# EasyEDA Pro project ProDoc_OHPP-005B.epro, board OHPP-005B
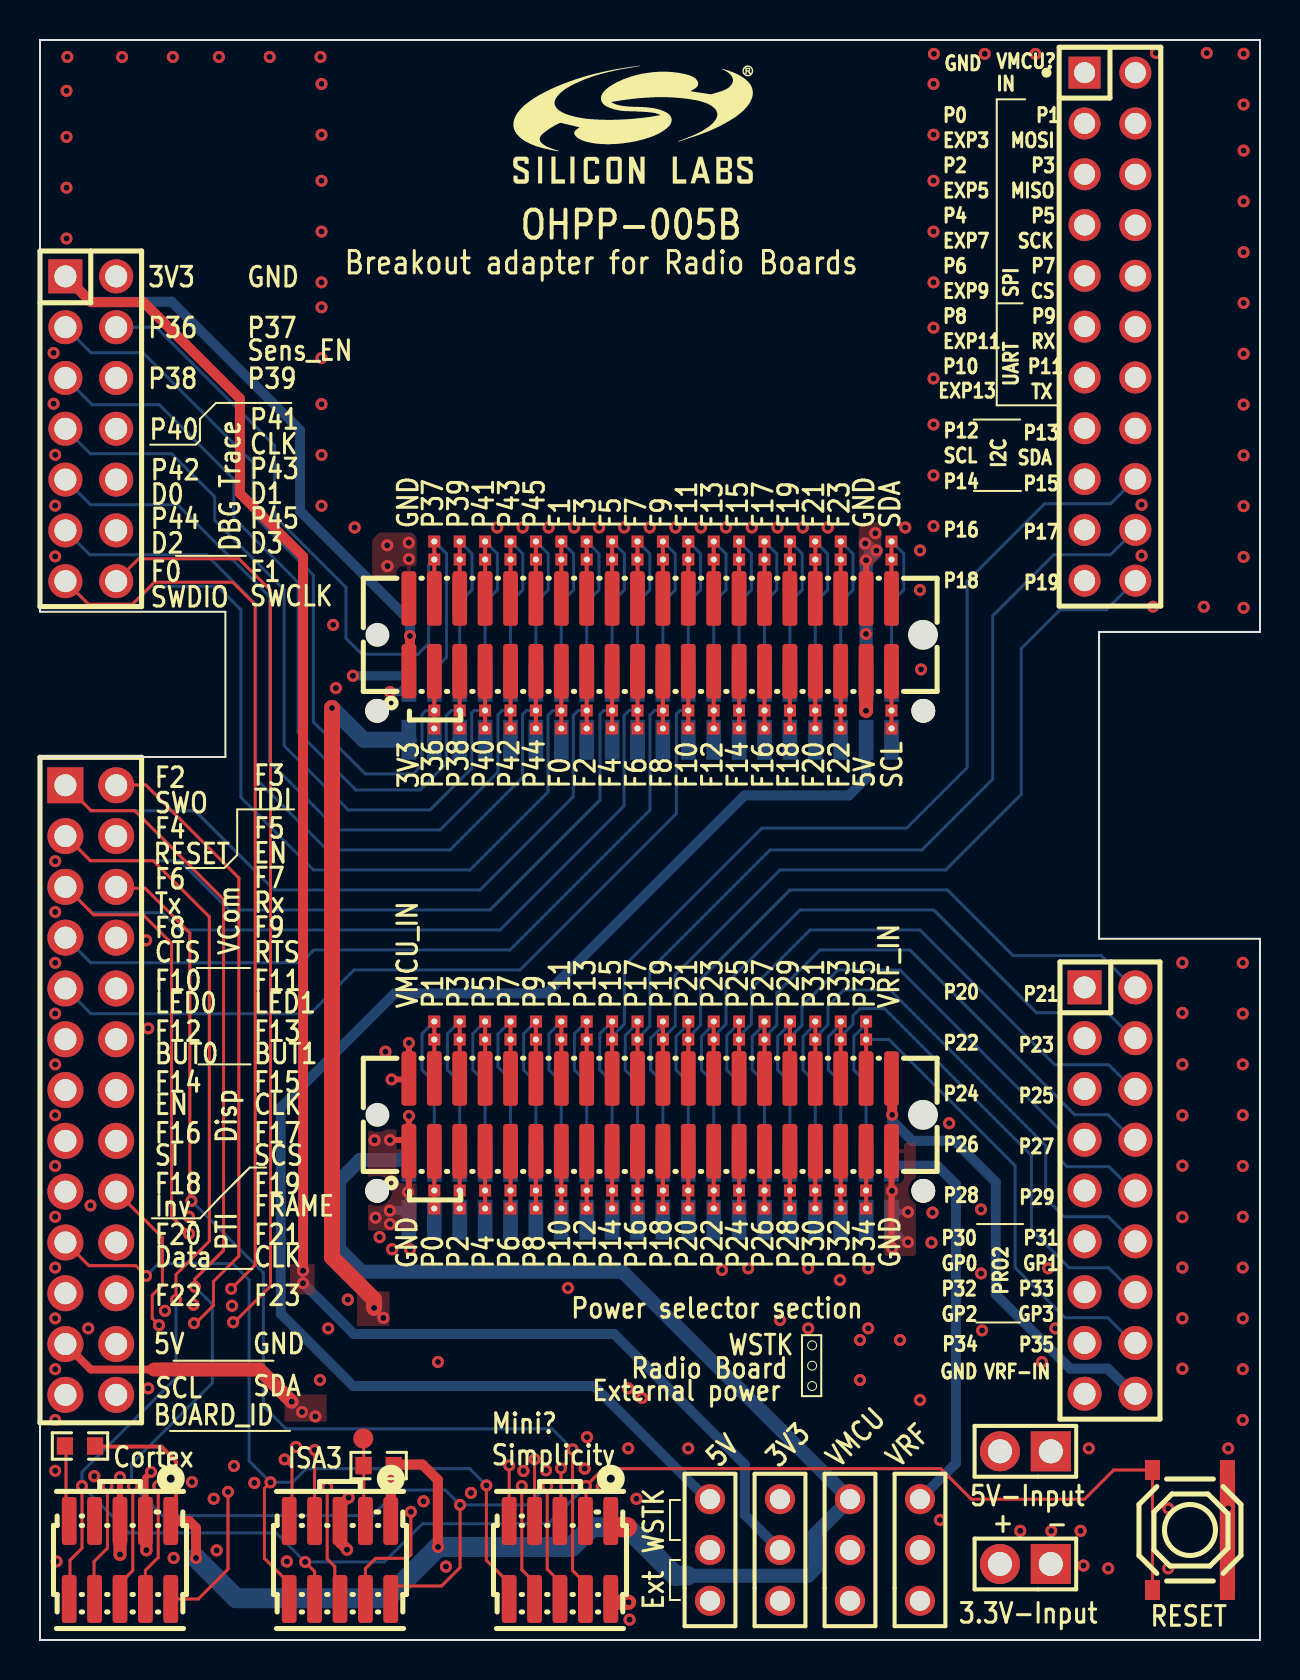
[diagram p3: board, top side]
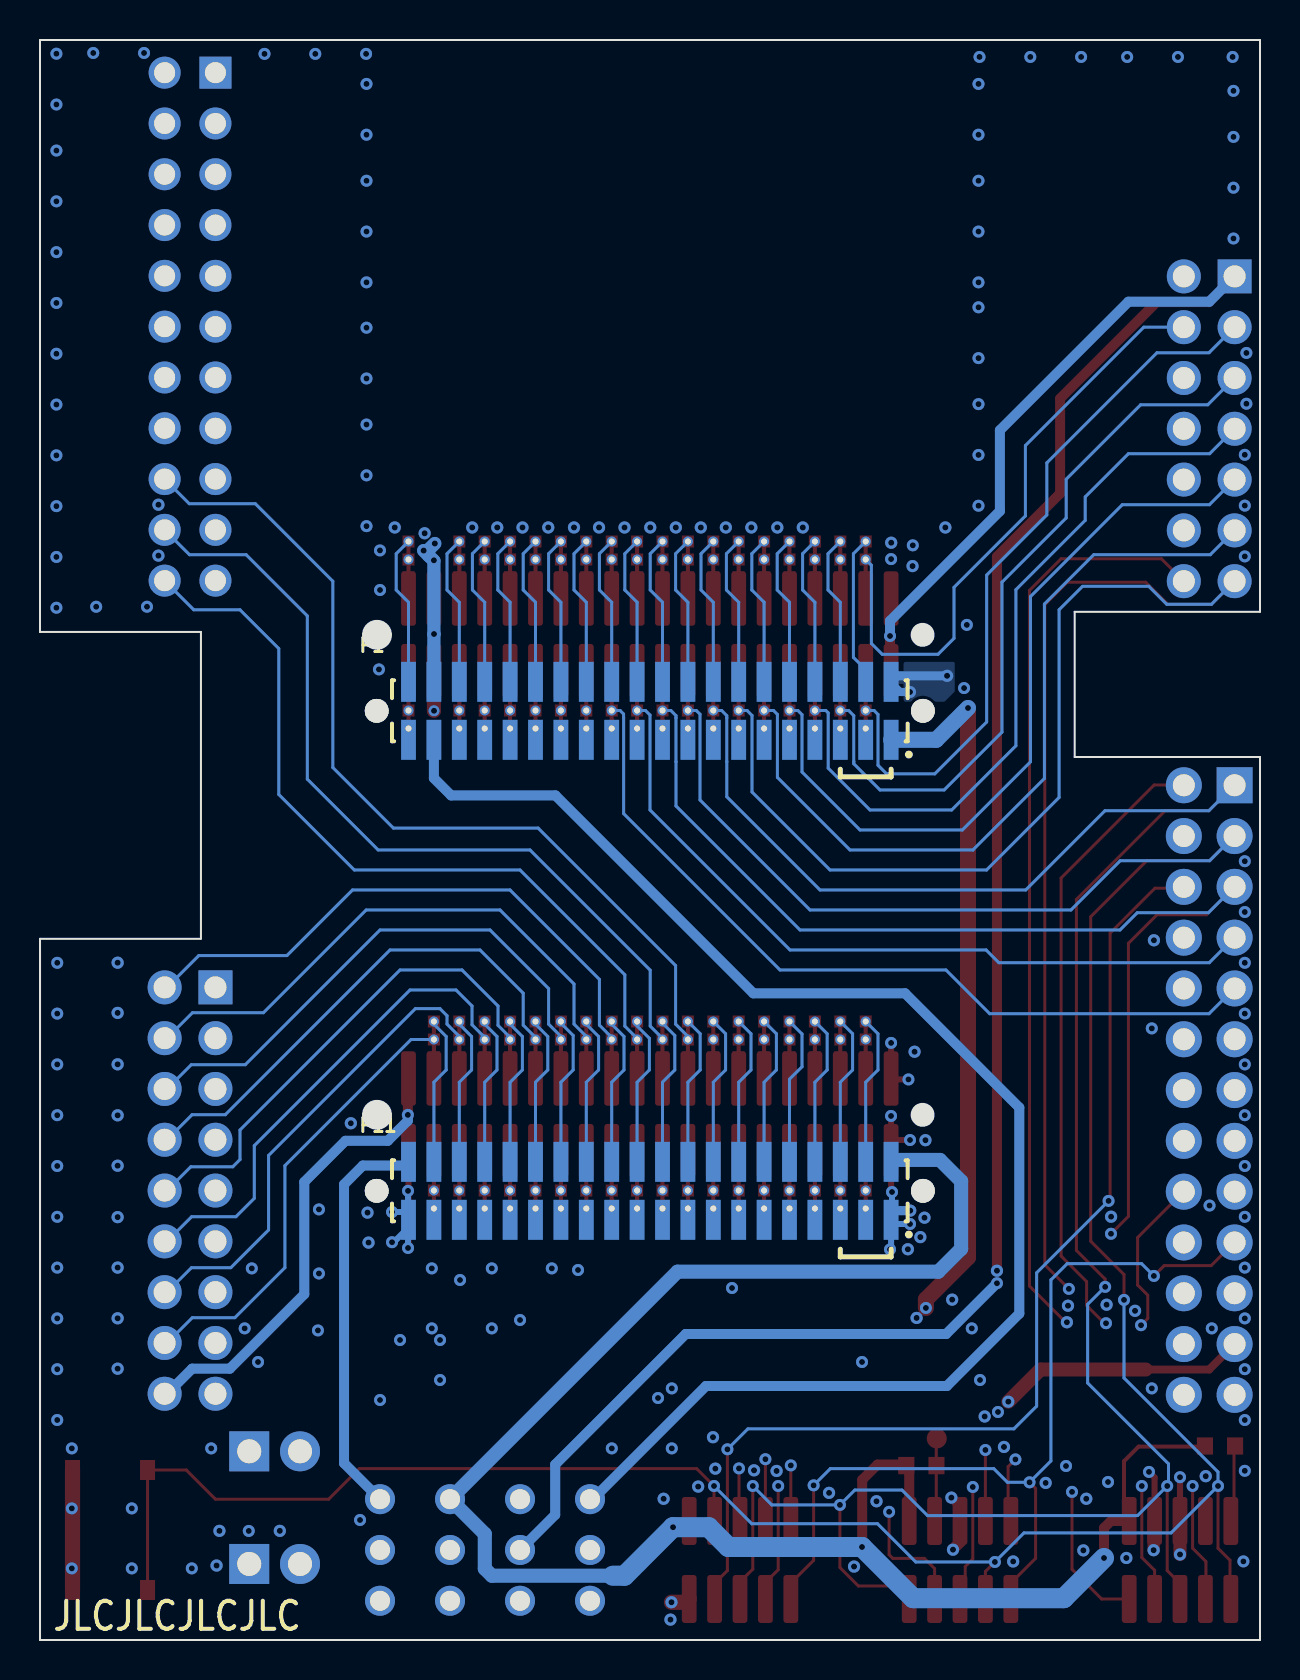
[diagram p4: board, bottom side, seen from below]

Outline 61 x 80 mm; copper layers: Top Layer, GND1, Inner1, Inner2, GND2, Bottom Layer. Coordinates in mm from the lower left corner of the outline.
Outline path: 61,8 61,35.06 52.96,35.06 52.96,50.4 61,50.4 61,80 0,80 0,51.41 9.27,51.41 9.27,44.15 0,44.15 0,0 61,0 61,34.5 ; 61,58.49 61,63
Stack: Top Layer 0.035mm Outer layer thickness 1oz / Dielectric1 0.0994mm 3313 RC57% 4.2mil / GND1 0.0152mm Inner layer thickness / Dielectric2 0.55mm 0.55mm H/H No copper / Inner1 0.0152mm Inner layer thickness / Dielectric3 0.1088mm 2116 RC54% 4.9mil / Inner2 0.0152mm Inner layer thickness / Dielectric4 0.55mm 0.55mm H/H No copper / GND2 0.0152mm Inner layer thickness / Dielectric5 0.0994mm 3313 RC57% 4.2mil / Bottom Layer 0.035mm Outer layer thickness 1oz

## Design rules (mm)
template: Custom Config
spacing copperThickness1oz (default): track to track 0.152, other pairs 0 to 0.3
spacing copperThickness2oz: track to track 0.203, other pairs 0.152 to 0.3
spacing copperThicknessInner0.5oz: track to track 0.089, other pairs 0.152 to 0.3
track width copperThickness1oz (default): min 0.15, default 0.15, max 2.54
track width copperThickness2oz: min 0.203, default 0.254, max 2.54
track width copperThickness0.5oz: min 0.089, default 0.254, max 2.54
differential pair differentialPair (default): width min 0.127, default 0.254, max 2.54; gap min 0.152, default 0.152
via viaSize (default): diameter min 0.3, default 0.61, max 10; hole min 0.2, default 0.305, max 6.3

## Placement (name value [footprint] x y rotation side)
H3  2.54-1*3  [HDR-TH_3P-P2.54-V-M-1]  40.5 4.5 90 top
H7  2.54-1*3  [HDR-TH_3P-P2.54-V-M-1]  44 4.5 90 top
H8  2.54-1*3  [HDR-TH_3P-P2.54-V-M-1]  37 4.5 90 top
H9  2.54-1*3  [HDR-TH_3P-P2.54-V-M-1]  33.5 4.5 90 top
H15  X6521WV-2x09H-C60D30  [HDR-TH_18P-P2.54-V-M-R2-C9-S2.54]  53.5 22.47 270 top
H16  X6521WV-2x11H-C60D30  [HDR-TH_22P-2.54-V-M-R2-C11-S2.54]  53.5 65.67 270 top
H17  X6521WV-2x13H-C60D30  [HDR-TH_26P-P2.54-V-M-R2-C13-S2.54]  2.54 27.5 270 top
H18  X6521WV-2x07H-C60D30  [HDR-TH_14P-P2.54-V-M-R2-C7-S2.54]  2.54 60.56 270 top
P1  *  [SAMTEC_SFC-120-T2-F-D-LC_1]  30.51 46.46 180 bottom
P3  3131-40MG0BK00T2  [CONN-SMD_40P-P1.27_WCON_3131-40MG0BK00T2_1]  30.51 50.26 180 top
P4  3131-40MG0BK00T2  [CONN-SMD_40P-P1.27_WCON_3131-40MG0BK00T2_1]  30.51 26.26 180 top
P5  -  [JUMPER_RECT_3PIN_NSNS]  19.72 22.47 90 top
P6  23bddce16d364f51bbc85156d37ba6bb  [IDC-SMD_3132-10MG0BK00R2_1]  26 4 180 top
P9  23bddce16d364f51bbc85156d37ba6bb  [IDC-SMD_3132-10MG0BK00R2_1]  4 4 180 top
P10  23bddce16d364f51bbc85156d37ba6bb  [IDC-SMD_3132-10MG0BK00R2_1]  15 4 180 top
P11  *  [SAMTEC_SFC-120-T2-F-D-LC_1]  30.51 22.46 180 bottom
P13  -  [JUMPER_RECT_3PIN_NSNS]  19.72 30.02 270 top
P14  -  [JUMPER_RECT_3PIN_NSNS]  20.99 22.47 90 top
P15  -  [JUMPER_RECT_3PIN_NSNS]  20.99 30.02 270 top
P16  -  [JUMPER_RECT_3PIN_NSNS]  22.26 22.47 90 top
P17  -  [JUMPER_RECT_3PIN_NSNS]  22.26 30.02 270 top
P18  -  [JUMPER_RECT_3PIN_NSNS]  23.53 22.47 90 top
P19  -  [JUMPER_RECT_3PIN_NSNS]  23.53 30.02 270 top
P20  -  [JUMPER_RECT_3PIN_NSNS]  24.8 22.47 90 top
P21  -  [JUMPER_RECT_3PIN_NSNS]  24.8 30.02 270 top
P22  -  [JUMPER_RECT_3PIN_NSNS]  26.07 22.47 90 top
P23  -  [JUMPER_RECT_3PIN_NSNS]  26.07 30.02 270 top
P24  -  [JUMPER_RECT_3PIN_NSNS]  27.34 22.47 90 top
P25  -  [JUMPER_RECT_3PIN_NSNS]  27.34 30.02 270 top
P26  -  [JUMPER_RECT_3PIN_NSNS]  28.61 22.47 90 top
P27  -  [JUMPER_RECT_3PIN_NSNS]  28.61 30.02 270 top
P28  -  [JUMPER_RECT_3PIN_NSNS]  29.88 22.47 90 top
P29  -  [JUMPER_RECT_3PIN_NSNS]  29.88 30.02 270 top
P30  -  [JUMPER_RECT_3PIN_NSNS]  31.15 22.47 90 top
P31  -  [JUMPER_RECT_3PIN_NSNS]  31.15 30.02 270 top
P32  -  [JUMPER_RECT_3PIN_NSNS]  32.42 22.47 90 top
P33  -  [JUMPER_RECT_3PIN_NSNS]  32.42 30.02 270 top
P34  -  [JUMPER_RECT_3PIN_NSNS]  33.69 22.47 90 top
P35  -  [JUMPER_RECT_3PIN_NSNS]  33.69 30.02 270 top
P36  -  [JUMPER_RECT_3PIN_NSNS]  34.96 22.47 90 top
P37  -  [JUMPER_RECT_3PIN_NSNS]  34.96 30.02 270 top
P38  -  [JUMPER_RECT_3PIN_NSNS]  36.23 22.47 90 top
P39  -  [JUMPER_RECT_3PIN_NSNS]  36.23 30.02 270 top
P40  -  [JUMPER_RECT_3PIN_NSNS]  37.5 22.47 90 top
P41  -  [JUMPER_RECT_3PIN_NSNS]  37.5 30.02 270 top
P42  -  [JUMPER_RECT_3PIN_NSNS]  38.77 22.47 90 top
P43  -  [JUMPER_RECT_3PIN_NSNS]  38.77 30.02 270 top
P44  -  [JUMPER_RECT_3PIN_NSNS]  40.04 22.47 90 top
P45  -  [JUMPER_RECT_3PIN_NSNS]  40.04 30.02 270 top
P46  -  [JUMPER_RECT_3PIN_NSNS]  41.31 22.47 90 top
P47  -  [JUMPER_RECT_3PIN_NSNS]  41.31 30.02 270 top
P48  -  [JUMPER_RECT_3PIN_NSNS]  19.72 46.47 90 top
P49  -  [JUMPER_RECT_3PIN_NSNS]  19.72 54.02 270 top
P50  -  [JUMPER_RECT_3PIN_NSNS]  20.99 46.47 90 top
P51  -  [JUMPER_RECT_3PIN_NSNS]  20.99 54.02 270 top
P52  -  [JUMPER_RECT_3PIN_NSNS]  22.26 46.47 90 top
P53  -  [JUMPER_RECT_3PIN_NSNS]  22.26 54.02 270 top
P54  -  [JUMPER_RECT_3PIN_NSNS]  23.53 46.47 90 top
P55  -  [JUMPER_RECT_3PIN_NSNS]  23.53 54.02 270 top
P56  -  [JUMPER_RECT_3PIN_NSNS]  24.8 46.47 90 top
P57  -  [JUMPER_RECT_3PIN_NSNS]  24.8 54.02 270 top
P58  -  [JUMPER_RECT_3PIN_NSNS]  26.07 46.47 90 top
P59  -  [JUMPER_RECT_3PIN_NSNS]  26.07 54.02 270 top
P60  -  [JUMPER_RECT_3PIN_NSNS]  27.34 46.47 90 top
P61  -  [JUMPER_RECT_3PIN_NSNS]  27.34 54.02 270 top
P62  -  [JUMPER_RECT_3PIN_NSNS]  28.61 46.47 90 top
P63  -  [JUMPER_RECT_3PIN_NSNS]  29.88 54.02 270 top
P64  -  [JUMPER_RECT_3PIN_NSNS]  28.61 54.02 270 top
P65  -  [JUMPER_RECT_3PIN_NSNS]  29.88 46.47 90 top
P66  -  [JUMPER_RECT_3PIN_NSNS]  31.15 46.47 90 top
P67  -  [JUMPER_RECT_3PIN_NSNS]  31.15 54.02 270 top
P68  -  [JUMPER_RECT_3PIN_NSNS]  32.42 46.47 90 top
P69  -  [JUMPER_RECT_3PIN_NSNS]  32.42 54.02 270 top
P70  -  [JUMPER_RECT_3PIN_NSNS]  33.69 46.47 90 top
P71  -  [JUMPER_RECT_3PIN_NSNS]  33.69 54.02 270 top
P72  -  [JUMPER_RECT_3PIN_NSNS]  34.96 46.47 90 top
P73  -  [JUMPER_RECT_3PIN_NSNS]  34.96 54.02 270 top
P74  -  [JUMPER_RECT_3PIN_NSNS]  36.23 46.47 90 top
P75  -  [JUMPER_RECT_3PIN_NSNS]  36.23 54.02 270 top
P76  -  [JUMPER_RECT_3PIN_NSNS]  37.5 46.47 90 top
P77  -  [JUMPER_RECT_3PIN_NSNS]  37.5 54.02 270 top
P78  -  [JUMPER_RECT_3PIN_NSNS]  38.77 46.47 90 top
P79  -  [JUMPER_RECT_3PIN_NSNS]  38.77 54.02 270 top
P80  -  [JUMPER_RECT_3PIN_NSNS]  40.04 46.47 90 top
P81  -  [JUMPER_RECT_3PIN_NSNS]  40.04 54.02 270 top
P82  -  [JUMPER_RECT_3PIN_NSNS]  42.58 54.02 270 top
P83  -  [JUMPER_RECT_3PIN_NSNS]  42.58 46.47 90 top
R1  100kΩ  [R0603]  2 9.7 0 top
R2  100kΩ  [R0603]  16.93 8.72 0 top
SW2  TS-1187A-B-A-B  [SW-SMD_4P-L5.1-W5.1-P3.70-LS6.5-TL_H1.5]  57.5 5.5 90 top
TP1  -  [Test-Point-0.5mm]  16.16 10.08 0 top
U1  2.54-1*2  [HDR-TH_2P-P2.54-V-M]  49.27 3.8 180 top
U3  2.54-1*2  [HDR-TH_2P-P2.54-V-M]  49.27 9.43 180 top

## Footprints (pads in the part's own frame, mm; a bottom-side part is the same pattern mirrored in y, then rotated)
CONN-SMD_40P-P1.27_WCON_3131-40MG0BK00T2_1
  rrect 0.74x2.72 smd: 1(12.065,1.815) 2(12.065,-1.815) 3(10.795,1.815) 4(10.795,-1.815) 5(9.525,1.815) 6(9.525,-1.815) 7(8.255,1.815) 8(8.255,-1.815) 9(6.985,1.815) 10(6.985,-1.815) 11(5.715,1.815) 12(5.715,-1.815) 13(4.445,1.815) 14(4.445,-1.815) 15(3.175,1.815) 16(3.175,-1.815) 17(1.905,1.815) 18(1.905,-1.815) 19(0.635,1.815) 20(0.635,-1.815) 21(-0.635,1.815) 22(-0.635,-1.815) 23(-1.905,1.815) 24(-1.905,-1.815) 25(-3.175,1.815) 26(-3.175,-1.815) 27(-4.445,1.815) 28(-4.445,-1.815) 29(-5.715,1.815) 30(-5.715,-1.815) 31(-6.985,1.815) 32(-6.985,-1.815) 33(-8.255,1.815) 34(-8.255,-1.815) 35(-9.525,1.815) 36(-9.525,-1.815) 37(-10.795,1.815) 38(-10.795,-1.815) 39(-12.065,1.815) 40(-12.065,-1.815)
HDR-TH_2P-P2.54-V-M
  rect 2x2 hole 1.2: 1(-1.27,0)
  round 2 hole 1.2: 2(1.27,0)
HDR-TH_3P-P2.54-V-M-1
  round 1.5 hole 1: 1(-2.54,0) 2(0,0) 3(2.54,0)
HDR-TH_14P-P2.54-V-M-R2-C7-S2.54
  rect 1.7x1.7 hole 1.1: 1(-7.62,-1.27)
  round 1.7 hole 1.1: 2(-7.62,1.27) 3(-5.08,-1.27) 4(-5.08,1.27) 5(-2.54,-1.27) 6(-2.54,1.27) 7(0,-1.27) 8(0,1.27) 9(2.54,-1.27) 10(2.54,1.27) 11(5.08,-1.27) 12(5.08,1.27) 13(7.62,-1.27) 14(7.62,1.27)
HDR-TH_18P-P2.54-V-M-R2-C9-S2.54
  rect 1.7x1.7 hole 1.1: 1(-10.16,-1.27)
  round 1.7 hole 1.1: 2(-10.16,1.27) 3(-7.62,-1.27) 4(-7.62,1.27) 5(-5.08,-1.27) 6(-5.08,1.27) 7(-2.54,-1.27) 8(-2.54,1.27) 9(0,-1.27) 10(0,1.27) 11(2.54,-1.27) 12(2.54,1.27) 13(5.08,-1.27) 14(5.08,1.27) 15(7.62,-1.27) 16(7.62,1.27) 17(10.16,-1.27) 18(10.16,1.27)
HDR-TH_22P-2.54-V-M-R2-C11-S2.54
  rect 1.6x1.6 hole 1.05: 1(-12.7,-1.27)
  round 1.6 hole 1.05: 2(-12.7,1.27) 3(-10.16,-1.27) 4(-10.16,1.27) 5(-7.62,-1.27) 6(-7.62,1.27) 7(-5.08,-1.27) 8(-5.08,1.27) 9(-2.54,-1.27) 10(-2.54,1.27) 11(0,-1.27) 12(0,1.27) 13(2.54,-1.27) 14(2.54,1.27) 15(5.08,-1.27) 16(5.08,1.27) 17(7.62,-1.27) 18(7.62,1.27) 19(10.16,-1.27) 20(10.16,1.27) 21(12.7,-1.27) 22(12.7,1.27)
HDR-TH_26P-P2.54-V-M-R2-C13-S2.54
  rect 1.8x1.8 hole 1.1: 1(-15.24,-1.27)
  round 1.8 hole 1.1: 2(-15.24,1.27) 3(-12.7,-1.27) 4(-12.7,1.27) 5(-10.16,-1.27) 6(-10.16,1.27) 7(-7.62,-1.27) 8(-7.62,1.27) 9(-5.08,-1.27) 10(-5.08,1.27) 11(-2.54,-1.27) 12(-2.54,1.27) 13(0,-1.27) 14(0,1.27) 15(2.54,-1.27) 16(2.54,1.27) 17(5.08,-1.27) 18(5.08,1.27) 19(7.62,-1.27) 20(7.62,1.27) 21(10.16,-1.27) 22(10.16,1.27) 23(12.7,-1.27) 24(12.7,1.27) 25(15.24,-1.27) 26(15.24,1.27)
IDC-SMD_3132-10MG0BK00R2_1
  rrect 0.74x2.4 smd: 1(-2.54,-1.95) 2(-2.54,1.95) 3(-1.27,-1.95) 4(-1.27,1.95) 5(0,-1.95) 6(0,1.95) 7(1.27,-1.95) 8(1.27,1.95) 9(2.54,-1.95) 10(2.54,1.95)
JUMPER_RECT_3PIN_NSNS
  round 0.5 hole 0.3: 1(-0.9,0) 2(0,0)
  rect 0.6x0.6 smd: 1(-0.9,0) 2(0,0) 3(0.9,0)
R0603
  rect 0.806x0.864 smd: 1(-0.753,0) 2(0.753,0)
SAMTEC_SFC-120-T2-F-D-LC_1
  round 1.19 hole 1.19: (-13.655,0) (13.655,0)
  rect 0.74x2 smd: 01(12.065,-1.45) 02(12.065,1.45) 03(10.795,-1.45) 04(10.795,1.45) 05(9.525,-1.45) 06(9.525,1.45) 07(8.255,-1.45) 08(8.255,1.45) 09(6.985,-1.45) 10(6.985,1.45) 11(5.715,-1.45) 12(5.715,1.45) 13(4.445,-1.45) 14(4.445,1.45) 15(3.175,-1.45) 16(3.175,1.45) 17(1.905,-1.45) 18(1.905,1.45) 19(0.635,-1.45) 20(0.635,1.45) 21(-0.635,-1.45) 22(-0.635,1.45) 23(-1.905,-1.45) 24(-1.905,1.45) 25(-3.175,-1.45) 26(-3.175,1.45) 27(-4.445,-1.45) 28(-4.445,1.45) 29(-5.715,-1.45) 30(-5.715,1.45) 31(-6.985,-1.45) 32(-6.985,1.45) 33(-8.255,-1.45) 34(-8.255,1.45) 35(-9.525,-1.45) 36(-9.525,1.45) 37(-10.795,-1.45) 38(-10.795,1.45) 39(-12.065,-1.45) 40(-12.065,1.45)
SW-SMD_4P-L5.1-W5.1-P3.70-LS6.5-TL_H1.5
  rect 1x0.75 smd: 1(-3,1.875) 2(3,1.875) 3(-3,-1.875) 4(3,-1.875)
Test-Point-0.5mm
  round 1 smd: 1(0,0)

## Nets
As in the schematic.

Pads without a net: P9 7

## Via types
v1: diameter 0.61, hole 0.305, Top Layer to Bottom Layer, 70 vias
v2: diameter 0.6, hole 0.3, Top Layer to Bottom Layer, 179 vias
v3: diameter 0.61, hole 0.3, Top Layer to Bottom Layer, 8 vias
v4: diameter 0.55, hole 0.3, Top Layer to Bottom Layer, 1 via

## Routing (per net, layer and track width the routed paths; a pad name or vN(x,y) marks a point on that pad's centre or on a via; arc(x,y) is an arc through that point)
3V3: length 62.5
  Top Layer w0.8: 14.6,46.6 14.6,19.13 16.71,17.03 v2(16.71,16.6)
  GND1 w0.658: v1(17.17,16.1) 17.17,16.14 v2(16.71,16.6)
  Inner1 w0.8: v2(16.71,16.6) 31.24,16.6 35.24,12.6 35.24,8.8 37,7.04
  Bottom Layer w0.8: 18.45,45.01 16.19,45.01 14.6,46.6
  vias: v2(14.6,46.6)
5V: length 73.4
  Bottom Layer w0.5: 33.33,7.07 27.7,12.7 15.66,12.7 12.04,16.32 12.04,26.62 17.75,32.33 25.33,32.33 35.23,42.23 40.44,42.23 41.31,43.09 41.31,45.01
GND: length 50.8
  Top Layer w0.15: P6.2 28.54,2.74
  Top Layer w0.3: 18.45,51.77 P3.2 ; v2(18.45,26.2) 18.45,26.2 18.45,25.06 18.39,25 v2(17.5,25) ; P4.39 42.58,19.63 v2(42.6,19.6) ; P4.1 18.45,22.45 18.4,22.4 ; P3.38 v2(41.31,53.99)
  Top Layer w0.305: v2(5.55,8.4) 5.27,8.12 P9.3 ; P9.5 v2(4,8.14)
  Top Layer w0.455: 15.45,7.14 15,6.69 P10.5
  Top Layer w0.556: 15.35,4.54 15,4.89 P10.5
  Top Layer w0.607: P9.3 5.32,5.9 v1(5.32,4.49)
  Top Layer w0.658: v1(4,4.28) P9.5
  Top Layer w0.759: SW2.4 SW2.3 ; v1(29.43,1.89) 28.7,1.89 P6.2
  Bottom Layer w0.3: v2(43.4,19.89) 43.31,19.89 42.7,20.5 ; 17.5,20.8 18.24,20.8 P11.01 18.45,19.58 v2(18.5,19.53) ; 18.4,21.47 18.4,22.4 ; v2(42.6,19.6) 42.6,22.5 ; 42.7,21.4 43.4,21.4
  Bottom Layer w0.404: P1.02 18.45,47.84 18,47.4 v2(17.5,47.4)
  Bottom Layer w0.455: P1.02 18.15,48.21 v1(15.65,48.21) ; v1(17.49,21.47) 18.4,21.47 18.4,21.05 P11.01
  Bottom Layer w0.658: 41.31,50.29 41.31,53.96 41.57,54.22 ; 41.31,50.29 P1.38 ; 41.31,50.29 v2(41.3,50.3) ; 41.57,54.22 v1(41.82,54.47) ; 41.57,54.22 41.57,54.51 v1(41.26,54.83)
  vias: v1(2.71,8.19) v1(6.25,16.46) v1(6.68,4.1) v1(7.67,16.76) v1(8.69,7.06) v1(8.83,4.48) v1(9.6,16.71) v1(12.8,9.65) v1(15.39,17.02) v1(15.43,7.12) v1(15.35,4.52) v1(15.73,55.63) v1(16.73,24.99) v1(16.78,21.12) v1(16.98,20.15) v1(17.27,29.41) v1(17.37,53.7) v1(17.61,19.54) v1(18.44,54.86) v1(19.18,6.94) v1(20.3,3.67) v1(22.86,55.63) v1(24.13,55.63) v1(24.17,8.45) v1(25.3,8.48) v1(25.43,55.63) v1(26.71,55.63) v1(27.35,10.14) v1(27.96,55.63) v1(28.09,7.67) v1(29.21,55.63) v1(29.48,1.02) v1(29.82,7.06) v1(30.49,55.63) v1(31.77,55.63) v1(33.05,55.63) v1(34.3,55.63) v1(35.59,55.63) v1(36.88,55.63) v1(38.14,55.63) v1(39.39,55.63) v1(41.77,55.34) v1(43.26,55.63) v1(44.63,21.37) v1(44.57,19.87) v1(49.01,5.46) v1(52.03,5.46) v1(52.17,3.72) v1(55.08,56.76) v1(55.08,54.22) v1(57.12,33.86) v1(57.12,31.35) v1(57.12,28.78) v1(57.12,26.23) v1(57.12,23.72) v1(57.12,21.14) v1(57.12,18.62) v1(57.12,16.08) v1(57.12,13.57) v2(0.68,64.35) v2(0.68,61.81) v2(0.76,59.26) v2(0.76,56.72) v2(0.76,54.18) v2(0.76,38.94) v2(0.76,36.4) v2(0.76,33.86) v2(0.76,31.32) v2(0.76,28.78) v2(0.76,26.24) v2(0.76,23.7) v2(0.76,21.16) v2(0.76,18.62) v2(0.76,16.08) v2(0.76,13.54) v2(0.76,11) v2(0.76,8.46) v2(0.83,3.93) v2(1.33,77.46) v2(1.33,75.15) v2(1.33,72.61) v2(1.33,70.07) v2(1.37,79.15) v2(2.41,15.58) v2(2.52,21.72) v2(4.1,79.15) v2(5.41,30.58) v2(5.41,12.58) v2(6.64,79.15) v2(7.6,7.9) v2(8.94,79.15) v2(9.7,8.7) v2(11.49,79.15) v2(14.03,79.15) v2(14,13) v2(14.08,77.8) v2(14.08,75.26) v2(14.08,72.96) v2(14.08,70.42) v2(14.08,67.88) v2(14.08,66.63) v2(14.08,64.09) v2(14.08,61.79) v2(14.08,59.25) v2(14.08,56.71) v2(14.41,15.58) v2(14.66,50.75) v2(14.8,47.6) v2(17.36,54.73) v2(17.5,20.8) v2(18.45,54.05) v2(18.4,22.4) v2(19.9,13.9) v2(26.4,17.6) v2(29.41,12.58) v2(29.41,9.58) v2(30.1,12.1) v2(32.41,9.58) v2(34.1,18.5) v2(35.41,18.58) v2(37,16) v2(38.41,18.58) v2(38.41,15.58) v2(40,18) v2(41,15) v2(41,13) v2(41.41,18.58) v2(41.41,15.58) v2(42.6,22.46) v2(43,15) v2(43.4,21.4) v2(44,54.48) v2(44,52.5) v2(44,12) v2(44.05,48.53) v2(44.7,79.31) v2(44.68,77.8) v2(44.68,75.26) v2(44.68,72.96) v2(44.68,70.42) v2(44.68,67.88) v2(44.68,65.61) v2(44.68,63.07) v2(44.68,60.77) v2(44.68,58.23) v2(44.68,55.69) v2(45,6) v2(47.05,21.53) v2(47.05,18.33) v2(47.1,15.48) v2(47.24,79.31) v2(49.78,79.31) v2(50.1,13.9) v2(50.41,18.58) v2(50.56,5.45) v2(50.77,15.58) v2(52.44,9.58) v2(53.41,3.58) v2(55.65,51.66) v2(55.8,79.35) v2(56.41,6.58) v2(56.41,3.58) v2(58.19,51.66) v2(58.34,79.35) v2(59.41,9.58) v2(59.41,6.58) v2(59.41,3.58) v2(60.14,33.86) v2(60.14,31.32) v2(60.14,28.78) v2(60.14,26.24) v2(60.14,23.7) v2(60.14,21.16) v2(60.14,18.62) v2(60.14,16.08) v2(60.14,13.54) v2(60.14,11) v2(60.18,79.31) v2(60.18,76.77) v2(60.18,74.47) v2(60.18,71.93) v2(60.18,69.39) v2(60.18,66.85) v2(60.18,64.31) v2(60.18,61.77) v2(60.18,59.23) v2(60.18,56.69) v2(60.18,54.15) v2(60.18,51.61) v3(5.3,34.99) v3(7.45,21.17) v3(10.72,7.85) v3(12.34,3.93) v3(21.55,7.36) v3(27.23,8.57) v3(45.46,25.84)
BOARD_ID_SDA: length 7.5
  Bottom Layer w0.15: P1.40 42.58,51.89 43.19,52.5 43.19,54.31 P82.1
CORTEX_NRESET: length 148.6
  Top Layer w0.15: 2.1,7.7 2.1,4.59 1.5,3.99 1.5,2.9 ; v2(6.8,17.01) 6.8,18.28 8.47,19.94 8.47,36.16 5.66,38.96 2.52,38.96 1.27,40.21 ; P6.3 27.3,5.98 v2(27.3,7.7) 28.17,8.57 45.04,8.57 46.57,7.04 52.22,7.04 53.69,8.5 SW2.2 SW2.1 ; P10.8 13.73,3.43 v2(13.25,3.9)
  Bottom Layer w0.15: v2(6.8,17.01) 6.8,13.1 2.1,8.4 2.1,7.7 4.45,5.35 11.8,5.35 v2(13.25,3.9) 17.21,3.9 19.12,5.81 25.41,5.81 27.3,7.7 ; 1.27,40.21 2.52,38.96 6.99,38.96 9.45,36.5 22.5,36.5 28,42 28,46.29 28.19,46.48 28.61,46.48
  vias: v2(2.1,7.7)
CORTEX_SWCLK_TCK: length 116.5
  Top Layer w0.15: 5.91,7.7 5.91,4.12 5.27,3.48 P9.4 ; 14.8,3.1 14.74,3.16 14.74,3.67 14.36,4.05 v2(14.36,7.65) ; H18.14 4.93,54.06 9.94,54.06 11.53,52.48 11.53,17.7 9.72,15.89 v3(9.66,15.89) ; 24.7,2.9 24.09,3.51 24.09,7.7
  Inner1 w0.15: v2(24.09,7.7) 22.31,5.92 20.55,5.92 20.04,6.43 20.04,7.09 19.48,7.65 v2(14.36,7.65) 12.98,6.27 7.34,6.27 v2(5.91,7.7) 9.66,11.45 v3(9.66,15.89)
  Inner2 w0.15: H18.14 9.48,52.94 10.61,51.82 23.86,51.82 P59.2
CORTEX_SWDIO_TMS: length 130.3
  Top Layer w0.15: P10.7 v2(13.73,9.5) ; H18.13 2.42,51.79 4.61,51.79 5.71,52.89 9.64,52.89 10.76,51.77 10.76,18.76 v2(9.56,17.56) ; P9.2 7.92,2.05 9.4,3.53 v2(9.4,7.41) ; P6.7 24.73,9.04
  Inner2 w0.15: v2(13.73,9.5) 8.62,14.61 8.62,16.62 v2(9.56,17.56) ; v2(13.73,9.5) 13.87,9.64 24.13,9.64 v2(24.73,9.04) ; v2(13.73,9.5) 13.73,8.43 12.14,6.83 9.97,6.83 v2(9.4,7.41)
  Bottom Layer w0.15: H18.13 2.42,51.79 4.66,51.79 5.56,52.68 8.87,52.68 10.04,51.51 10.04,42.13 13.67,38.5 21.5,38.5 25.4,42.4 25.4,46.23 25.65,46.48 26.07,46.48
CORTEX_SWO_TDO: length 117.7
  Top Layer w0.15: v2(21,6.75) 21,3.63 20.08,2.7 17.69,2.7 17.54,2.55 P10.2 ; 26,2.9 25.36,3.54 25.36,7.7 ; v2(7.74,17.66) 7.74,18.04 9.18,19.48 9.18,37.03 4.74,41.46 2.56,41.46 1.27,42.75 ; 4.64,7.7 4.64,3.47 4,2.83 P9.6
  Bottom Layer w0.15: 1.27,42.75 2.56,41.46 7.75,41.46 11.71,37.5 22,37.5 26.66,42.16 26.66,43.91 26.66,43.91 26.66,46.1 26.66,46.1 26.66,46.22 26.92,46.48 27.34,46.48 ; v2(7.74,17.66) 8.62,16.78 8.62,12.85 4.58,8.81 4.58,7.77 6.12,6.22 16.63,6.22 17.9,7.5 20.26,7.5 v2(21,6.75) 24.41,6.75 25.36,7.7
  vias: v2(4.64,7.7) v2(25.36,7.7)
CORTEX_TDI: length 100.3
  Top Layer w0.15: P10.4 16.27,3.57 16.78,4.08 18.36,4.08 18.54,4.26 v2(18.54,6.41) ; v2(7.7,15.84) 7.78,15.84 8.67,16.73 8.67,17.92 9.94,19.2 9.94,38.1 5.29,42.75 3.81,42.75 ; 3.37,7.7 3.37,4.59 2.7,3.92 2.7,3 2.8,2.9
  Inner1 w0.15: P61.2 25.03,51.71 14.03,51.71 11.93,49.62 11.93,44.98 9.69,42.74 H17.2 ; v2(7.7,15.84) 7.7,13.16 3.37,8.83 v2(3.37,7.7) 6.02,5.05 17.18,5.05 v2(18.54,6.41)
EXT_3V3: length 11.8
  Inner2 w1.42: H8.1 H3.1 H7.1 46.16,1.96 U1.2
EXT_5V: length 20
  Inner1 w0.658: H9.1 34.81,3.27 37.74,3.27
  Inner1 w0.759: U3.2 40.34,9.43 38.76,7.85 38.76,3.76 38.27,3.27 37.74,3.27
H_BOARD_ID_SCL: length 60
  Inner2 w0.15: 1.27,12.27 2.57,13.57 4.33,13.57 5.05,14.28 5.05,16.52 6.73,18.21 6.73,22.24 10.82,26.32 10.82,27.82 23.75,40.75 36.85,40.75 P83.2
H_BOARD_ID_SDA: length 64.8
  Inner1 w0.15: 3.81,12.27 5.13,13.59 5.13,16.45 9.54,20.86 9.54,24.78 24.33,39.57 36.32,39.57 40.6,43.85 40.6,47.69 42.59,49.67 42.59,54.02 P82.2
H_WSTK_F5: length 31
  Inner2 w0.15: P64.2 25.28,50.7 20.01,50.7 18.44,49.12 15.31,49.12 13.72,47.53 13.72,46.67 7.26,40.21 3.81,40.21
H_WSTK_F6: length 87.5
  Top Layer w0.15: v2(26.05,8.58) 26.05,6 P6.5 ; 1.27,37.67 2.68,36.26 5.15,36.26 6.58,34.83 6.58,21.18 v2(7.45,20.31)
  Inner2 w0.15: v2(26.05,8.58) 26.05,10.57 24.58,12.04 13.87,12.04 11.23,14.68 11.23,18.4 9.32,20.31 v2(7.45,20.31)
  Bottom Layer w0.15: 29.88,46.48 29.46,46.48 29.2,46.22 29.2,46.1 29.2,46.1 29.2,43.91 29.2,43.91 29.2,41.7 23,35.5 7,35.5 6.14,36.36 2.58,36.36 1.27,37.67
H_WSTK_F7: length 87.6
  Top Layer w0.15: 3.81,37.67 3.89,37.59 5.25,37.59 7.49,35.35 7.49,22.03 v2(7.57,21.96) ; 27.2,2.9 26.63,3.47 v2(26.63,9.53)
  Inner1 w0.15: H17.6 6.65,37.66 13.77,44.77 13.77,47.63 15.25,49.11 18.56,49.11 19.78,50.34 26.19,50.34 P63.2
  Bottom Layer w0.15: v2(7.57,21.96) 11.17,18.36 11.17,11.69 12.3,10.56 25.61,10.56 v2(26.63,9.53)
H_WSTK_F8: length 38.4
  Bottom Layer w0.15: 1.27,35.13 2.54,33.86 13.06,33.86 13.69,34.5 23.5,34.5 30.5,41.5 30.5,46.25 30.73,46.48 31.15,46.48
H_WSTK_F9: length 35.6
  Inner2 w0.15: P67.2 26.75,49.63 20.27,49.63 18.64,48 16.43,48 15.56,47.12 15.56,46.36 4.33,35.13 3.81,35.13
H_WSTK_F10: length 40.9
  Bottom Layer w0.15: 1.27,32.59 2.55,31.31 13.51,31.31 15.7,33.5 24,33.5 31.82,41.32 ; 31.82,41.32 31.82,46.1 ; 32.42,46.48 32,46.48 31.82,46.3 31.82,46.1
H_WSTK_F11: length 39
  Inner1 w0.15: P69.2 27.4,49.01 19.94,49.01 19.02,48.09 16.7,48.09 15.5,46.9 15.5,44.28 3.81,32.59
H_WSTK_F12: length 40.9
  Inner1 w0.15: P70.2 32.78,47.38 19.48,47.38 18.41,46.31 18.41,44.78 4.95,31.31 2.53,31.31 1.27,30.05
H_WSTK_F13: length 40.8
  Inner2 w0.15: P71.2 28.18,48.51 20.57,48.51 7.24,35.18 7.24,33.48 3.81,30.05
H_WSTK_F14: length 43.5
  Inner2 w0.15: P72.2 34.05,47.38 21.08,47.38 20.3,46.6 20.3,44.53 4.53,28.76 2.52,28.76 1.27,27.51
H_WSTK_F15: length 47
  Inner1 w0.15: P73.2 34.31,53.38 34.31,45.07 33.74,44.5 20.8,44.5 3.81,27.51
H_WSTK_F16: length 44.4
  Inner1 w0.15: P74.2 35.65,45.9 35.65,44.93 34.27,43.55 21.88,43.55 4.59,26.27 2.57,26.27 1.27,24.97
H_WSTK_F17: length 50.2
  Inner2 w0.15: 3.81,24.97 6.5,27.66 6.5,29.36 21.87,44.73 35.03,44.73 35.6,45.3 35.6,53.4 P75.2
H_WSTK_F18: length 47.8
  Inner2 w0.15: P76.2 36.85,45.83 36.85,45.16 35.6,43.91 22.37,43.91 7.57,29.11 7.57,26.95 4.33,23.72 2.56,23.72 1.27,22.43
H_WSTK_F19: length 87.3
  Top Layer w0.15: v2(5.95,15.74) 5.61,16.08 5.61,17.24 6.12,17.75 6.12,20.12 3.81,22.43 ; 12.23,9.03 12.6,8.66 12.6,6.09 P10.9 ; P6.9 23.46,8.73
  Inner1 w0.15: v2(12.23,9.03) 12.53,8.73 v2(23.46,8.73) ; P77.2 36.85,53.38 36.85,44.71 34.78,42.64 22.75,42.64 5.2,25.09 5.2,24.28 3.81,22.88 3.81,22.43
  Inner2 w0.15: v2(12.23,9.03) 5.95,15.31 v2(5.95,15.74)
H_WSTK_F20: length 93.6
  Top Layer w0.15: v2(5.31,18.2) 4.79,18.72 2.44,18.72 1.27,19.89 ; 12.4,2.9 11.22,4.08 11.22,7.58 v2(11.52,7.88) ; 23.4,2.9 22.32,3.98 v2(22.32,7.73)
  Inner1 w0.15: P78.2 38.2,45.91 38.2,44.52 35.34,41.67 23.67,41.67 5.61,23.61 5.61,21.98 4.74,21.11 2.49,21.11 1.27,19.89
  Bottom Layer w0.15: v2(5.31,18.2) 5.92,18.82 9.64,18.82 10.46,18 10.46,8.95 v2(11.52,7.88) 12.63,7.88 13.31,8.57 21.48,8.57 v2(22.32,7.73)
H_WSTK_F21: length 56.3
  Inner2 w0.15: 3.81,19.89 5.15,21.23 5.15,23.1 8.59,26.54 8.59,28.75 22.78,42.94 35.94,42.94 38.2,45.2 38.2,53.46 P79.2
H_WSTK_F22: length 54.2
  Inner1 w0.15: 1.73,17.35 1.73,17.53
  Inner2 w0.15: P80.2 39.37,45.81 39.37,44.87 36.46,41.96 23.32,41.96 9.65,28.3 9.65,26.43 5.86,22.64 5.86,20.04 4.44,18.62 2.53,18.62 1.27,17.35
H_WSTK_F23: length 58.6
  Inner1 w0.15: P81.2 39.39,53.38 39.39,44.19 35.85,40.65 24.02,40.65 6.68,23.31 6.68,20.76 3.81,17.89 3.81,17.35
H_WSTK_P0: length 74.5
  Inner1 w0.15: H16.3 45.49,69.09 45.49,43.86 37.89,36.26 24.76,36.26 20.36,31.86 20.36,23.12 P5.2
H_WSTK_P1: length 69.9
  Inner2 w0.15: P13.2 20.36,30.67 20.36,32.36 24.83,36.83 38.83,36.83 46.87,44.87 46.87,70.33 51.05,74.51 53.46,74.51 H16.4
H_WSTK_P2: length 72
  Inner2 w0.15: P14.2 21.62,23.11 21.62,32.12 25.21,35.71 39.33,35.71 47.48,43.86 47.48,68.54 H16.5
H_WSTK_P3: length 66.9
  Inner1 w0.15: P15.2 21.62,30.66 21.62,31.62 25.09,35.09 38.91,35.09 46.36,42.53 46.36,67.52 50.85,72.01 53.5,72.01 H16.6
H_WSTK_P4: length 69.1
  Inner1 w0.15: P16.2 22.9,23.12 22.9,31.4 25.52,34.02 39.93,34.02 47.28,41.36 47.28,65.79 H16.7
H_WSTK_P5: length 63.9
  Inner2 w0.15: P17.2 23,30.77 23,32 25.65,34.65 39.85,34.65 48.09,42.89 48.09,66.4 51.15,69.46 53.49,69.46 H16.8
H_WSTK_P6: length 65.9
  Inner2 w0.15: H16.9 48.71,64.68 48.71,41.93 40.36,33.58 26.18,33.58 24.16,31.56 24.16,23.11 P18.2
H_WSTK_P7: length 61.3
  Inner1 w0.15: H16.10 53.53,66.96 51.15,66.96 48.14,63.95 48.14,40.19 40.85,32.9 25.9,32.9 24.2,31.2 24.2,30.7 P19.2
H_WSTK_P8: length 63.8
  Inner1 w0.15: P20.2 25.44,23.12 25.44,31.14 26.23,31.93 41.97,31.93 49.01,38.96 49.01,62.42 52.23,65.64 H16.11
H_WSTK_P9: length 57.8
  Inner2 w0.15: P21.2 25.5,30.73 25.5,31.5 26.61,32.61 40.98,32.61 49.32,40.95 49.32,62.48 51.26,64.41 53.52,64.41 H16.12
H_WSTK_P10: length 59.9
  Inner2 w0.15: H16.13 49.93,60.83 49.93,40.09 41.49,31.65 27.15,31.65 26.7,31.2 26.7,23.11 P22.2
H_WSTK_P11: length 56.7
  Inner1 w0.15: H16.14 53.51,61.86 51.26,61.86 49.88,60.49 49.88,37.58 41.31,29.02 27.07,29.02 P23.2
H_WSTK_P12: length 53.6
  Inner1 w0.15: H16.15 50.75,59.1 50.75,37.03 41.62,27.9 32.76,27.9 P24.2
H_WSTK_P13: length 52.7
  Inner2 w0.15: P25.2 28.05,29.31 41.86,29.31 42.74,30.19 42.74,31.57 50.54,39.37 50.54,58.45 51.41,59.31 53.5,59.31 H16.16
H_WSTK_P14: length 51.8
  Inner2 w0.15: H16.17 53.5,56.78 53.5,54.72 53.04,54.26 51.71,54.26 51.15,53.7 51.15,38.3 44.01,31.16 44.01,30.09 42.12,28.19 34.32,28.19 P26.2
H_WSTK_P15: length 45
  Bottom Layer w0.15: 28.61,30.08 28.61,30.18 29.22,30.79 29.22,33.72 36.09,40.6 43.33,40.6 46.36,43.62 46.36,52.94 50.24,56.81 53.54,56.81 H16.18
H_WSTK_P16: length 47.9
  Inner1 w0.15: P28.2 34.18,26.78 41.92,26.78 51.79,36.65 51.79,50.47 53.5,52.17 53.5,54.24 H16.19
H_WSTK_P17: length 41.8
  Bottom Layer w0.15: 29.88,30.08 30.49,30.69 30.49,33.49 36.5,39.5 44.09,39.5 47.63,43.04 47.63,51.2 50.69,54.26 53.53,54.26 H16.20
H_WSTK_P18: length 43.1
  Inner2 w0.15: P30.2 35.59,26.92 42.17,26.92 52.07,36.82 52.07,52.81 H16.21
H_WSTK_P19: length 38.9
  Bottom Layer w0.15: H16.22 53.31,51.51 51,51.51 49.06,49.57 49.06,42.28 45.28,38.5 37,38.5 31.76,33.26 31.76,30.69 31.15,30.08
H_WSTK_P20: length 25.3
  Inner1 w0.15: 52.15,32.59 46.41,26.85 46.41,25.7 45.49,24.79 42.77,24.79 41.9,25.65 35.59,25.65 P32.2
H_WSTK_P21: length 28.8
  Bottom Layer w0.15: 32.42,30.08 32.42,30.13 33.03,30.74 33.03,33.03 37.5,37.5 45.37,37.5 48.65,34.22 53.06,34.22 54.69,32.59
H_WSTK_P22: length 22.2
  Inner2 w0.15: 52.15,30.05 50.47,30.05 45.36,24.94 42.89,24.94 42.13,25.7 36.91,25.7 P34.2
H_WSTK_P23: length 27.6
  Bottom Layer w0.15: 54.69,30.05 53.38,31.37 49.83,31.37 44.69,36.5 38,36.5 34.3,32.8 34.3,30.79 33.69,30.18 33.69,30.08
H_WSTK_P24: length 20
  Inner1 w0.15: 52.15,27.51 50.31,27.51 46.41,23.61 42.48,23.61 41.57,24.53 37.01,24.53 P36.2
H_WSTK_P25: length 26.4
  Bottom Layer w0.15: 54.69,27.51 53.44,28.76 50.74,28.76 44,35.5 38.5,35.5 35.57,32.57 35.57,30.79 34.96,30.18 34.96,30.08
H_WSTK_P26: length 17
  Inner2 w0.15: 52.15,24.97 48.07,24.97 47.28,24.18 37.93,24.18 P38.2
H_WSTK_P27: length 25.2
  Bottom Layer w0.15: 36.23,30.08 36.23,30.13 36.84,30.74 36.84,32.34 39,34.5 43.5,34.5 51.74,26.27 53.4,26.27 54.69,24.97
H_WSTK_P28: length 17.5
  Inner1 w0.15: P40.2 38.43,23.41 41.31,23.41 41.92,22.8 41.92,21.68 42.89,20.71 48.14,20.71 49.87,22.43 52.15,22.43
H_WSTK_P29: length 24.7
  Bottom Layer w0.15: 54.69,22.43 53.46,23.66 51.36,23.66 51,24.02 51,25.5 43,33.5 39.9,33.5 38.1,31.7 38.1,30.73 37.5,30.13 P41.2
H_WSTK_P30: length 15.2
  Inner2 w0.15: 52.15,19.89 50.75,19.89 47.28,23.36 39.65,23.36 P42.2
H_WSTK_P31: length 24.3
  Bottom Layer w0.15: P43.2 38.77,30.13 39.4,30.76 39.4,31.7 40.2,32.5 42.5,32.5 50.29,24.71 50.29,22.08 51.2,21.17 53.42,21.17 54.69,19.89
H_WSTK_P32: length 15.1
  Inner1 w0.15: P44.2 40.7,21.81 40.7,20.45 43.8,17.35 52.15,17.35 ; 40.04,22.37 40.09,22.42
H_WSTK_P33: length 23.6
  Bottom Layer w0.15: 40.04,30.08 40.04,30.18 40.65,30.79 40.65,31.21 41,31.57 42.23,31.57 49.57,24.23 49.57,20.5 51.46,18.62 53.43,18.62 54.69,17.35
H_WSTK_P34: length 15.6
  Inner2 w0.15: P46.2 42,21.78 42,19.05 46.24,14.81 52.15,14.81
H_WSTK_P35: length 22.7
  Bottom Layer w0.15: P47.2 42.45,30.03 48.76,23.72 48.76,18.62 51.26,16.12 53.38,16.12 54.69,14.81
H_WSTK_P36: length 36.3
  Bottom Layer w0.15: 19.72,46.48 19.3,46.48 19.1,46.28 19.1,43.74 18.67,43.31 16.26,43.31 13.67,45.9 13.67,53.24 10.66,56.25 10.66,58.85 5.15,64.36 2.55,64.36 H18.3
H_WSTK_P37: length 30.5
  Bottom Layer w0.15: H18.4 5.81,65.64 11.73,59.72 11.73,56.2 15.3,52.63 15.3,50.08 16.1,49.28 18.89,49.28 19.43,49.83 19.43,53.74 P49.2
H_WSTK_P38: length 36.8
  Bottom Layer w0.15: 20.99,46.48 20.57,46.48 20.31,46.22 20.31,43.91 20.31,43.91 20.31,43.81 19,42.5 15.79,42.5 12.9,45.39 12.9,52.89 9.69,56.1 9.69,58.04 5.97,61.76 2.61,61.76 H18.5
H_WSTK_P39: length 22.3
  Inner2 w0.15: P51.2 20.37,54.64 20.37,55.27 20.04,55.6 16.99,55.6 15.81,54.42 12.49,54.42 H18.6
H_WSTK_P40: length 37.8
  Bottom Layer w0.15: H18.7 2.52,59.31 6.58,59.31 8.74,57.15 8.74,55.98 12.21,52.51 12.21,44.71 15.42,41.5 19.5,41.5 21.59,43.59 21.59,46.35 21.71,46.48 22.26,46.48
H_WSTK_P41: length 22.4
  Inner1 w0.15: H18.8 6.91,60.56 12.95,54.52 15.86,54.52 16.93,55.59 21.27,55.59 21.64,55.22 21.64,54.64 P53.2
H_WSTK_P42: length 38.5
  Bottom Layer w0.15: H18.9 2.53,56.76 6.89,56.76 11.47,52.17 11.47,43.91 14.89,40.5 20,40.5 22.9,43.4 22.9,46.27 23.11,46.48 23.53,46.48
H_WSTK_P43: length 22.1
  Inner2 w0.15: P55.2 22.59,53.09 11.69,53.09 6.75,58.02 H18.10
H_WSTK_P44: length 40
  Bottom Layer w0.15: H18.11 2.49,54.26 8.31,54.26 10.78,51.8 10.78,43.08 14.36,39.5 20.5,39.5 24.13,43.13 24.13,46.28 24.33,46.48 24.8,46.48
H_WSTK_P45: length 22.5
  Inner1 w0.15: H18.12 9.44,55.48 12.04,52.89 23.66,52.89 P57.2
ISA3_#JRT: length 4.5
  Top Layer w0.15: 16.27,8.5 16.19,8.42 16.19,6.03 P10.3 ; 16.3,8.5 16.19,8.61 16.19,10.22 16.3,10.33
R_3V3: length 116.9
  Top Layer w0.5: H18.1 2.56,66.89 5.17,66.89 10,62.07 10,57.32 13.15,54.17 v1(13.15,18.46) ; P3.1 18.5,48.5 18.5,50.2
  GND1 w0.658: v1(13.15,18.46) v2(13.15,17.84)
  Bottom Layer w0.5: H8.2 35.24,6.26 35.24,8.77 28.71,15.3 15.69,15.3 v2(13.15,17.84) ; 18.5,50.2 18.5,50.95 13,56.45 13,60.49 6.58,66.91 2.54,66.91 H18.1
  vias: v2(18.5,50.2)
R_5V: length 94.9
  Top Layer w0.395: 5.71,13.52 2.54,13.52 H17.23
  Top Layer w0.7: 5.71,13.52 10.98,13.52 v1(12.59,11.92) ; P3.37 41.31,46.47 v4(41.3,46.46)
  GND1 w0.709: v1(13.77,11.18) 13.33,11.18 v2(13.1,11.4) v1(12.59,11.92)
  Inner1 w0.7: 13.77,11.4 29.04,11.4 31.21,9.22 31.21,6.65 33.33,4.53 ; v2(13.1,11.4) 13.1,16.42 14.53,17.85 14.53,28 24.48,37.94 37.18,37.94 42.28,43.04 42.28,44.49 41.3,45.47 v4(41.3,46.46)
R_VMCU_IN: length 122.9
  Top Layer w0.3: 18.45,27.77 18.19,28.03 v2(17.58,28.03) ; P4.2 18.45,29.86
  Inner2 w0.543: H16.2 53.45,77.05 50.48,77.05 50.39,76.96
  Inner2 w1: 50.39,76.96 49.22,76.96 45.7,73.45 45.7,45.85 38.66,38.81 24.38,38.81 18.45,32.87 v2(18.45,29.85) 18.45,28.9 v2(17.58,28.03) 16.09,28.03 14.99,26.93 14.99,20.09 19.28,15.81 32.18,15.81 38.71,9.28 38.71,6.29 40.5,4.5
R_VRF_IN: length 39.1
  Top Layer w0.5: v2(42.61,26.26) 42.61,28.04 P4.40
  Inner1 w0.7: 44,4.5 45.35,4.5 47.84,6.99 52.94,6.99 54.69,8.74 54.69,12.27
  Bottom Layer w0.5: 54.69,12.27 53.4,13.57 51.51,13.57 47.79,17.29 47.79,22.9 45.73,24.96 43.61,24.96 42.61,25.96 v2(42.61,26.26)
VMCU_DEBUG: length 95.9
  Top Layer w0.2: 2.7,9.7 2.73,9.67 6.07,9.67 6.8,8.94 6.8,6.21 P9.1
  Top Layer w0.5: 7.8,4.1 7.8,5.6 7.45,5.95 P9.1 ; 17.73,8.53 17.55,8.53 17.54,8.51 P10.1 ; v2(19.9,4.65) 19.89,4.66 19.89,8.01 19.12,8.77 18.03,8.77
  Top Layer w1: 28.85,5.64 v2(29.35,5.64)
  Bottom Layer w0.7: 32.36,3.21 38.41,3.21 38.76,3.57 38.76,5.3 H3.3 29.13,18.41 16.09,18.41 14.94,19.56 14.94,22.94 16,24 18.35,24 P11.02
  Bottom Layer w1: 32.36,3.21 31.78,3.21 v2(29.35,5.64) 27.57,5.64 26.58,4.65 v2(19.9,4.65) 17.34,2.09 9.81,2.09 7.8,4.1
  vias: v2(7.8,4.1)
VRF_IN: length 20.2
  Bottom Layer w0.5: H7.3 45.8,8.84 45.8,22.78 44.86,23.72 42.76,23.72 P11.40
WSTK_F1: length 7.5
  Bottom Layer w0.15: P59.1 26.68,54.31 26.68,52.5 26.07,51.89 P1.14
WSTK_F3: length 7.5
  Bottom Layer w0.15: P1.16 27.34,51.89 27.95,52.5 27.95,54.31 P61.1
WSTK_F5: length 7.5
  Bottom Layer w0.15: P1.18 28.61,51.89 29.22,52.5 29.22,54.31 P64.1
WSTK_F7: length 7.5
  Bottom Layer w0.15: P1.20 29.88,51.89 30.49,52.5 30.49,54.31 P63.1
WSTK_F9: length 7.5
  Bottom Layer w0.15: P67.1 31.76,54.31 31.76,52.5 31.15,51.89 P1.22
WSTK_F11: length 7.5
  Bottom Layer w0.15: P1.24 32.42,51.89 33.03,52.5 33.03,54.31 P69.1
WSTK_F13: length 7.5
  Bottom Layer w0.15: P1.26 33.69,51.89 34.3,52.5 34.3,54.31 P71.1
WSTK_F15: length 7.5
  Bottom Layer w0.15: P73.1 35.57,54.31 35.57,52.5 34.96,51.89 P1.28
WSTK_F17: length 7.5
  Bottom Layer w0.15: P1.30 36.23,51.89 36.84,52.5 36.84,54.31 P75.1
WSTK_F19: length 7.5
  Bottom Layer w0.15: P1.32 37.5,51.89 38.11,52.5 38.11,54.31 P77.1
WSTK_F21: length 7.5
  Bottom Layer w0.15: P79.1 39.38,54.31 39.38,52.5 38.77,51.89 P1.34
WSTK_F23: length 7.5
  Bottom Layer w0.15: P1.36 40.04,51.89 40.65,52.5 40.65,54.31 P81.1
WSTK_P1: length 7.5
  Bottom Layer w0.15: P11.04 19.72,27.89 19.1,28.5 19.1,30.31 P13.1
WSTK_P3: length 7.5
  Bottom Layer w0.15: P11.06 20.99,27.89 20.37,28.5 20.37,30.31 P15.1
WSTK_P5: length 7.5
  Bottom Layer w0.15: P11.08 22.26,27.89 21.64,28.5 21.64,30.31 P17.1
WSTK_P7: length 7.5
  Bottom Layer w0.15: P11.10 23.53,28.04 22.9,28.66 22.9,30.3 P19.1
WSTK_P9: length 7.5
  Bottom Layer w0.15: P21.1 24.18,30.31 24.18,28.5 24.8,27.89 P11.12
WSTK_P11: length 7.5
  Bottom Layer w0.15: P11.14 26.07,27.89 25.45,28.5 25.45,30.31 P23.1
WSTK_P13: length 7.5
  Bottom Layer w0.15: P11.16 27.34,27.89 26.72,28.5 26.72,30.31 P25.1
WSTK_P15: length 7.5
  Bottom Layer w0.15: P11.18 28.61,27.89 27.99,28.5 27.99,30.31 P27.1
WSTK_P17: length 7.5
  Bottom Layer w0.15: P29.1 29.88,30.84 29.26,30.23 29.26,28.5 29.88,27.89 P11.20
WSTK_P19: length 7.5
  Bottom Layer w0.15: P11.22 31.15,27.89 30.53,28.5 30.53,30.08 31.15,30.7 P31.1
WSTK_P21: length 7.5
  Bottom Layer w0.15: P11.24 32.42,27.89 31.8,28.5 31.8,30.18 32.42,30.79 P33.1
WSTK_P23: length 7.5
  Bottom Layer w0.15: P11.26 33.69,27.89 33.07,28.5 33.07,30.18 33.69,30.79 P35.1
WSTK_P25: length 7.5
  Bottom Layer w0.15: P11.28 34.96,27.89 34.34,28.5 34.34,30.23 34.96,30.84 P37.1
WSTK_P27: length 7.5
  Bottom Layer w0.15: P39.1 36.23,30.79 35.61,30.18 35.61,28.5 36.23,27.89 P11.30
WSTK_P29: length 7.5
  Bottom Layer w0.15: P41.1 37.5,30.79 36.88,30.18 36.88,28.5 37.5,27.89 P11.32
WSTK_P31: length 7.5
  Bottom Layer w0.15: P43.1 38.77,30.79 38.15,30.18 38.15,28.5 38.77,27.89 P11.34
WSTK_P33: length 7.5
  Bottom Layer w0.15: P45.1 40.04,30.79 39.42,30.18 39.42,28.5 40.04,27.89 P11.36
WSTK_P35: length 7.5
  Bottom Layer w0.15: P11.38 41.31,27.89 40.69,28.5 40.69,30.18 41.31,30.79 P47.1
WSTK_P37: length 7.5
  Bottom Layer w0.15: P1.04 19.72,48.52 20.33,49.13 20.33,54.31 P49.1
WSTK_P39: length 7.5
  Bottom Layer w0.15: P51.1 21.6,54.31 21.6,52.5 20.99,51.89 P1.06
WSTK_P41: length 7.5
  Bottom Layer w0.15: P53.1 22.87,54.31 22.87,52.5 22.26,51.89 P1.08
WSTK_P43: length 7.5
  Bottom Layer w0.15: P1.10 23.53,51.89 24.14,52.5 24.14,54.31 P55.1
WSTK_P45: length 7.5
  Bottom Layer w0.15: P57.1 25.41,54.31 25.41,52.5 24.8,51.89 P1.12
$2N1020: length 3.8
  Top Layer w0.15: 1.3,9.7 1.3,6.11 P9.9

## Copper pours and planes (outline as drawn; the poured copper is in the pictures)
3V3 on Top Layer: 15.85,17.42 17.47,17.42 17.47,15.7 15.85,15.7
3V3 on Inner1: 15.85,17.42 17.73,17.42 17.73,15.65 15.85,15.65
GND on Top Layer: 18.82,20.48 18.82,25.52 16.4,25.52 16.4,20.48
GND on Top Layer: 40.94,50.85 40.94,55.73 41.1,55.88 42.06,55.88 42.06,54.15 41.66,53.75 41.66,51.26 41.25,50.85
GND on Top Layer: 18.82,53.17 18.82,55.14 18.59,55.37 16.97,55.37 16.61,55.02 16.61,53.17
GND on Top Layer: 42.22,24.85 43.79,24.85 43.79,19.2 42.22,19.2
GND on Bottom Layer: 15.26,48.91 18.81,48.91 18.81,46.91 15.77,46.91 15.26,47.43
GND on GND1: -1.43,81.96 62.63,81.96 62.63,-1.07 -1.43,-1.07
GND on GND2: -2.81,82.21 63.19,82.21 63.19,-2.24 -2.81,-2.24
R_3V3 on Top Layer: 12.5,18.8 13.73,18.8 13.73,17.26 12.5,17.26
R_3V3 on Inner2: 12.5,18.8 13.73,18.8 13.73,17.26 12.5,17.26
R_5V on Top Layer: 12.22,12.28 14.33,12.28 14.33,10.92 12.22,10.92
R_5V on Inner1: 12.22,12.28 14.33,12.28 14.33,10.92 12.22,10.92

## Text on the board
Bottom Silkscreen Layer: JLCJLCJLCJLC
Top Silkscreen Layer: EXP13 | P30 | GP0 | P32 | GP2 | P34 | P0 | EXP3 | P2 | EXP5 | P4 | EXP7 | P6 | EXP9 | P8 | EXP11 | P10 | P12 | SCL | P14 | P16 | P18 | P20 | P22 | P24 | P26 | P28 | GND | VRF-IN | VMCU / IN | MOSI | MISO | SDA | SCK | GP3 | P23 | P25 | P27 | P33 | P35 | P29 | GP1 | P13 | P15 | P17 | P21 | P31 | P19 | P11 | CS | P3 | P5 | P7 | RX | TX | P9 | P1 | I2C | PRO2 | SPI | UART | Cortex | 3V3 | P36 | P38 | P40 | P42 | D0 | P44 | D2 | F0 | SWDIO | RESET | BOARD_ID | 5V | F2 | SWO | F4 | F6 | Tx | F8 | CTS | F10 | LED0 | F12 | BUT0 | F14 | EN | F16 | SI | F18 | Inv | F20 | Data | F22 | P37 | Sens_EN | P39 | P41 | CLK | P43 | D1 | P45 | D3 | F1 | SWCLK | F3 | TDI | F5 | F7 | Rx | F9 | RTS | F11 | LED1 | F13 | BUT1 | F15 | F17 | SCS | F19 | FRAME | F21 | F23 | ISA3 | Mini / Simplicity | Power selector section | External power | Radio Board | WSTK | 3.3V-Input | 5V-Input | + | - | VMCU | VRF | PTI | Disp | VCom | DBG Trace | VMCU_IN | Ext | VRF_IN | Breakout adapter for Radio Boards | OHPP-005B
